# Altium schematic sheet Overview.SchDoc: OMAV_OrinNX_A603_Board
size A4; Date: 27.02.2025; ApprovedBy: no entry; CheckedBy: no entry; Author: Lennert Matthias Maurer; CompanyName: ETH Zürich; DrawnBy: Lennert Matthias Maurer; Engineer: Lennert Matthias Maurer; Organization: ETH Zürich; Address1: Autonomous Systems Lab; Address2: Leonhardstrasse 21; Address3: 8092 Zurich; Address4: Swizerland; DocumentNumber: 1; Revision: 0; SheetNumber: 1; SheetTotal: 2; Time: 18:36; ImagePath: no entry; Application_BuildNumber: no entry
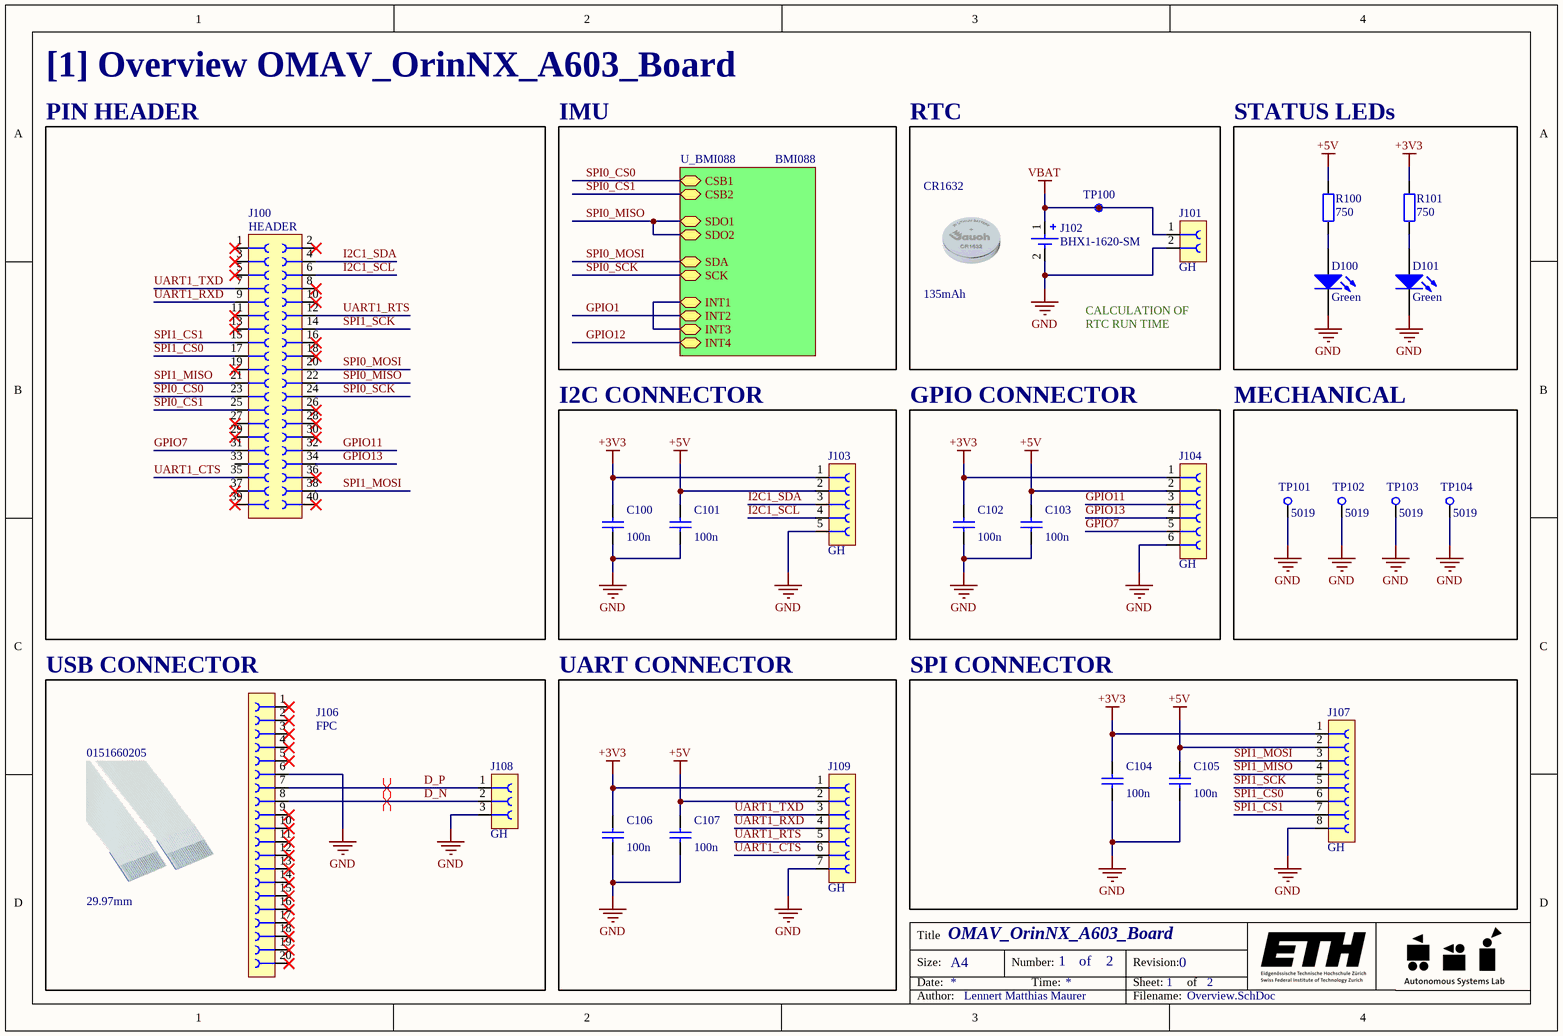
[diagram p0: Overview.SchDoc]

## Parts
C100  value 100n  [SMD_CAPC2012X12N]  (hidden comment: C0603)
C101  value 100n  [SMD_CAPC2012X12N]  (hidden comment: C0603)
C102  value 100n  [SMD_CAPC2012X12N]  (hidden comment: C0603)
C103  value 100n  [SMD_CAPC2012X12N]  (hidden comment: C0603)
C104  value 100n  [SMD_CAPC2012X12N]  (hidden comment: C0603)
C105  value 100n  [SMD_CAPC2012X12N]  (hidden comment: C0603)
C106  value 100n  [SMD_CAPC2012X12N]  (hidden comment: C0603)
C107  value 100n  [SMD_CAPC2012X12N]  (hidden comment: C0603)
D100  value Green  [SMD_LED_0402]  (hidden comment: Kingbright APHHS1005LCGCK)
D101  value Green  [SMD_LED_0402]  (hidden comment: Kingbright APHHS1005LCGCK)
J100  HEADER  [NPTC202KFMS-RC]
J101  GH  [SMD_CONN_JST_GH_FEMALE _2-POLES_1.25mm_VERTICAL]
J102  BHX1-1620-SM  [BHX1-1620-SM]
J103  GH  [SMD_CONN_JST_GH_FEMALE _5-POLES_1.25mm_VERTICAL]
J104  GH  [SMD_CONN_JST_GH_FEMALE _6-POLES_1.25mm_VERTICAL]
J106  FPC  [5034802000]
J107  GH  [SMD_CONN_JST_GH_FEMALE _8-POLES_1.25mm_VERTICAL]
J108  GH  [SMD_CONN_JST_GH_FEMALE _3-POLES_1.25mm_VERTICAL]
J109  GH  [SMD_CONN_JST_GH_FEMALE _7-POLES_1.25mm_VERTICAL]
MEC100  CR1632  value 135mAh
MEC101  0151660205  value 29.97mm
R100  value 750  [SMD_RESC1005X04N]  (hidden comment: R0402)
R101  value 750  [SMD_RESC1005X04N]  (hidden comment: R0402)
TP100  Test Point Small  [SMD_PAD_0.5mm]  (value not drawn)  (no BOM)
TP101  5019  [KEYSTONE_5019]
TP102  5019  [KEYSTONE_5019]
TP103  5019  [KEYSTONE_5019]
TP104  5019  [KEYSTONE_5019]

## Blocks framed on the sheet
PIN HEADER: J100
RTC: J101 J102 MEC100 TP100
STATUS LEDs: D100 D101 R100 R101
I2C CONNECTOR: C100 C101 J103
GPIO CONNECTOR: C102 C103 J104
MECHANICAL: TP101-TP104
USB CONNECTOR: J106 J108 MEC101
UART CONNECTOR: C106 C107 J109
SPI CONNECTOR: C104 C105 J107

## Sub-sheets
U_BMI088 = BMI088: INT2 (bidir), INT4 (bidir), SDA (bidir), SDO1 (bidir), SDO2 (bidir), CSB1 (bidir), CSB2 (bidir), INT1 (bidir), INT3 (bidir), SCK (bidir)

## Nets
+3V3: C100.2 C102.2 C104.2 C106.2 J103.1 J104.1 J107.1 J109.1 R101.2
+5V: C101.2 C103.2 C105.2 C107.2 J103.2 J104.2 J107.2 J109.2 R100.2
GND: C100.1 C101.1 C102.1 C103.1 C104.1 C105.1 C106.1 C107.1 D100.1(K) D101.1(K) J101.2 J102.2(-) J103.5 J104.6 J106.6 J107.8 J108.3 J109.7 TP101.1 TP102.1 TP103.1 TP104.1
VBAT: J101.1 J102.1(+) TP100.1
D_N: J106.8 J108.2
D_P: J106.7 J108.1
GPIO1: sheet U_BMI088/INT2
GPIO7: J100.31 J104.5
GPIO11: J100.32 J104.3
GPIO12: sheet U_BMI088/INT4
GPIO13: J100.34 J104.4
I2C1_SCL: J100.6 J103.4
I2C1_SDA: J100.4 J103.3
SPI0_CS0: J100.23 ; sheet U_BMI088/CSB1
SPI0_CS1: J100.25 ; sheet U_BMI088/CSB2
SPI0_MISO: J100.22 ; sheet U_BMI088/SDO1, sheet U_BMI088/SDO2
SPI0_MOSI: J100.20 ; sheet U_BMI088/SDA
SPI0_SCK: J100.24 ; sheet U_BMI088/SCK
SPI1_CS0: J100.17 J107.6
SPI1_CS1: J100.15 J107.7
SPI1_MISO: J100.21 J107.4
SPI1_MOSI: J100.38 J107.3
SPI1_SCK: J100.14 J107.5
UART1_CTS: J100.35 J109.6
UART1_RTS: J100.12 J109.5
UART1_RXD: J100.9 J109.4
UART1_TXD: J100.7 J109.3
NetD100_2: D100.2(A) R100.1
NetD101_2: D101.2(A) R101.1
(unnamed): sheet U_BMI088/INT1, sheet U_BMI088/INT3

Not connected (* = marked no-connect by the designer): J100 1* 2* 3* 5* 8* 10* 11* 13* 16* 18* 19* 26* 27* 28* 29* 30* 33 36* 37* 39* 40*; J106 1* 2* 3* 4* 5* 9* 10* 11* 12* 13* 14* 15* 16* 17* 18* 19* 20*

## Layout directives
differential pair: D_N, D_P

## Notes on the sheet
- [1] Overview OMAV_OrinNX_A603_Board
- IMU
- CALCULATION OF RTC RUN TIME
- Title
- Size:
- Date:
- A4
- Number:
- Time:
- of
- Revision:
- Sheet:
- Author:
- Filename:

## Library data of the parts
C100-C107 = CMP-02803-1: CERCAP 100n 100V 10% X7R 0603; Manufacturer: Murata; Manufacturer Part Number: GRM188R72A104KA35D; Supplier: Digi-Key; Supplier Part Number: 490-3285-1-ND
D100 D101 = CMPL-001-0467-9: LED GREEN 2mA  1.9V 1x 0.5mm; Manufacturer: Kingbright USA; Manufacturer Part Number: APHHS1005LCGCK; Supplier: DigiKey; Supplier Part Number: 754-2121-1-ND
J100 = CMP-03091-6: RECT-CONN Female 40-Poles 2.54mm Vertical SMD 12.55x51.3mm; Manufacturer: Sullins Connector Solutions; Manufacturer Part Number: NPTC202KFMS-RC; Supplier Part Number: S5690-ND; Supplier: Digi-Key
J101 = CMPL-001-0040-5: CONN Female GH 2-Poles 1.25mm Vertical SMD 5.75x4.05mm; Manufacturer: JST Sales America Inc.; Manufacturer Part Number: BM02B-GHS-TBT(LF)(SN)(N); Supplier: Digi-Key; Supplier Part Number: 455-1578-1-ND
J102 = CMP-03366-1: EMECH SINGLE COIN BATTERY RETAINER SMD 16x3.55mm; Manufacturer: MPD (Memory Protection Devices); Manufacturer Part Number: BHX1-1620-SM; Supplier: DigiKey; Supplier Part Number: BHX1-1620-SM-ND
J103 = CMPL-001-0043-4: CONN Female GH 5-Poles 1.25mm Vertical SMD 9.50x4.05mm; Manufacturer: JST Sales America Inc.; Manufacturer Part Number: BM05B-GHS-TBT(LF)(SN)(N); Supplier: Digi-Key; Supplier Part Number: 455-1581-1-ND
J104 = CMPL-001-0044-3: CONN Female GH 6-Poles 1.25mm Vertical SMD 10.75x4.05mm; Manufacturer: JST Sales America Inc.; Manufacturer Part Number: BM06B-GHS-TBT(LF)(SN)(N); Supplier: Digi-Key; Supplier Part Number: 455-1582-1-ND
J106 = CMP-03367-1: FPC TOP/BOTTOM 20POS 0.5mm Horizontal SMD; Manufacturer: Molex; Manufacturer Part Number: 5034802000; Supplier: Digi-Key; Supplier Part Number: WM1445CT-ND
J107 = CMPL-001-0046-4: CONN Female GH 8-Poles 1.25mm Vertical SMD 13.25x4.05mm; Manufacturer: JST Sales America Inc.; Manufacturer Part Number: 455-1584-1-ND; Supplier: Digi-Key; Supplier Part Number: 455-1584-1-ND
J108 = CMPL-001-0041-3: CONN Female GH 3-Poles 1.25mm Vertical SMD 7.00x4.05mm; Manufacturer: JST Sales America Inc.; Manufacturer Part Number: SM03B-GHS-TB(LF)(SN); Supplier: Digi-Key; Supplier Part Number: 455-1565-1-ND
J109 = CMPL-001-0045-4: CONN Female GH 7-Poles 1.25mm Vertical SMD 12.00x4.05mm; Manufacturer: JST Sales America Inc.; Manufacturer Part Number: BM07B-GHS-TBT(LF)(SN)(N); Supplier: Digi-Key; Supplier Part Number: 455-1583-1-ND
MEC100 = CMP-03368-3: EMECH SINGLE 3V LITHIUM BATTERY 16mm; Manufacturer: Jauch Quartz; Manufacturer Part Number: CR1632; Supplier: Digi-Key; Supplier Part Number: 3027-CR1632-B-ND
MEC101 = CMP-03369-2: EMECH SINGLE FFC CABLE 20-Pin 0.5mm 29.97mm; Manufacturer: Molex; Manufacturer Part Number: 0151660205; Supplier: Digi-Key; Supplier Part Number: 0151660205-ND
R100 R101 = CMP-01442-1: RES 750 100mW 1% 0402; Manufacturer: Panasonic Electronic Components; Manufacturer Part Number: ERJ-2RKF7500X; Supplier: Digi-Key; Supplier Part Number: P750LCT-ND
TP100 = CMP-02902-6: TP TESTPOINT MULTIPLE_SIZE
TP101-TP104 = CMPL-001-0505-10: TP SMD 3.81x 2.03mm; Manufacturer: Keystone Electronics; Design Item ID: 5019; Source: 5019.SchLib; Manufacturer Part Number: 5019; Supplier: Digi-Key; Supplier Part Number: 36-5019CT-ND